# Altium schematic sheet Accelometer and Gyroscope.SchDoc: Title
size A4; Date: *******; ApprovedBy: *******; CheckedBy: Yasiru Banayake; Author: *******; CompanyName: *******; DrawnBy: Name; Engineer: *******; Organization: *******; Address1: *******; Address2: *******; Address3: *******; Address4: *******; DocumentNumber: Doc Num; Revision: *******; SheetNumber: 2; SheetTotal: 11; Subtitle: Accelometer JST; Project: Resturant Robot; VersionRevision: III; TotalSheet: 11; CurrentTime: *******; CurrentDate: *******; Time: *******; DocumentFullPathAndName: *******; DocumentName: *******; ModifiedDate: *******; ImagePath: *******; ProjectName: *******; Application_BuildNumber: *******
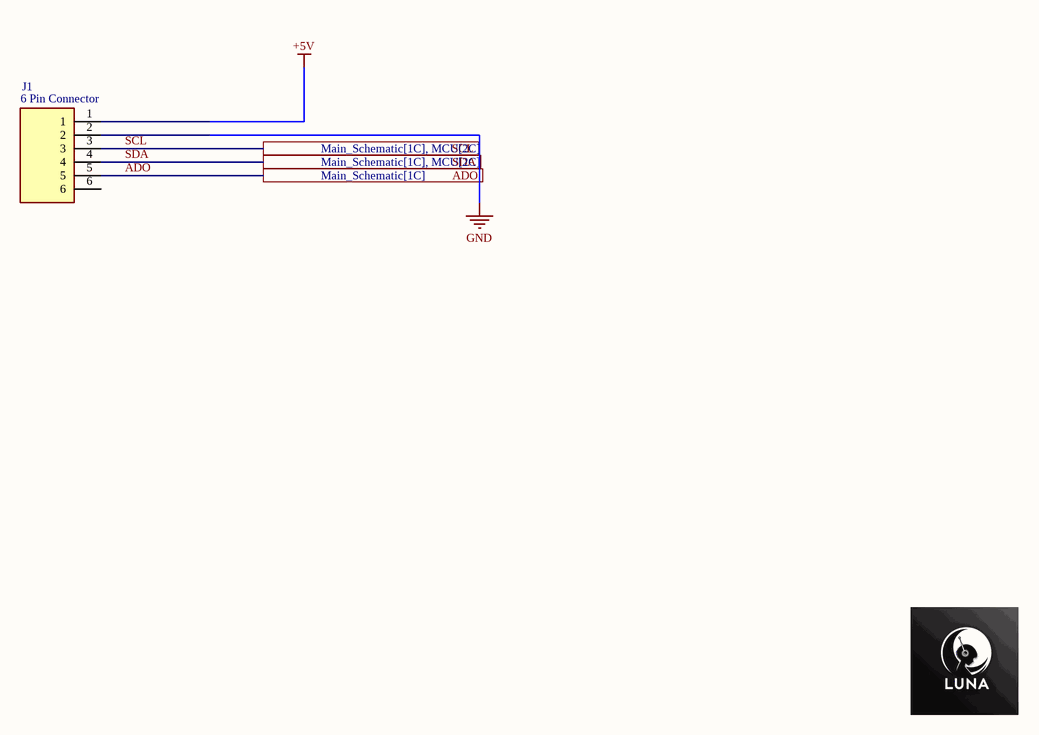
[diagram p0: Accelometer and Gyroscope.SchDoc]

## Parts
J1  6 Pin Connector  [SHDR6W64P0X250_1X6_1740X575X700P]

## Ports
ADO (see Main_Schematic[1C]), SCL (see Main_Schematic[1C], MCU[2C]), SDA (see Main_Schematic[1C], MCU[2C])

## Nets
+5V: J1.1
GND: J1.2
ADO: J1.5 ; port ADO
SCL: J1.3 ; port SCL
SDA: J1.4 ; port SDA

Not connected (* = marked no-connect by the designer): J1 6

## Notes on the sheet
- Title:
- Drawn By:
- Page Contents:
- Checked By:
- Subtitle:
- University Of Moratuwa
- Moratuwa
- Size:
- Date:
- File:
- Email:
- A4
- lasithnawanjaan123@gmail.com
- Lasith Haputhanthri
- Number:
- Time:
- Revision:
- Sheet
- of
- Katubedda
- 10500
- Sri Lanka

## Library data of the parts
J1 = B6B-XH-A_LF__SN_: B6B-XH-A_LF__SN_ Connector; Manufacturer_Name: JST (JAPAN SOLDERLESS TERMINALS); Manufacturer_Part_Number: B6B-XH-A(LF)(SN); Datasheet Link: https://datasheet.lcsc.com/szlcsc/JST-Sales-America-B6B-XH-A-LF-SN_C144397.pdf; Height: 7mm; Arrow Part Number: B6B-XH-A(LF)(SN); Arrow Price/Stock: https://www.arrow.com/en/products/b6b-xh-a-lf-sn/jst-manufacturing?region=europe